# EAGLE design yaw (EAGLE 9.6.2)
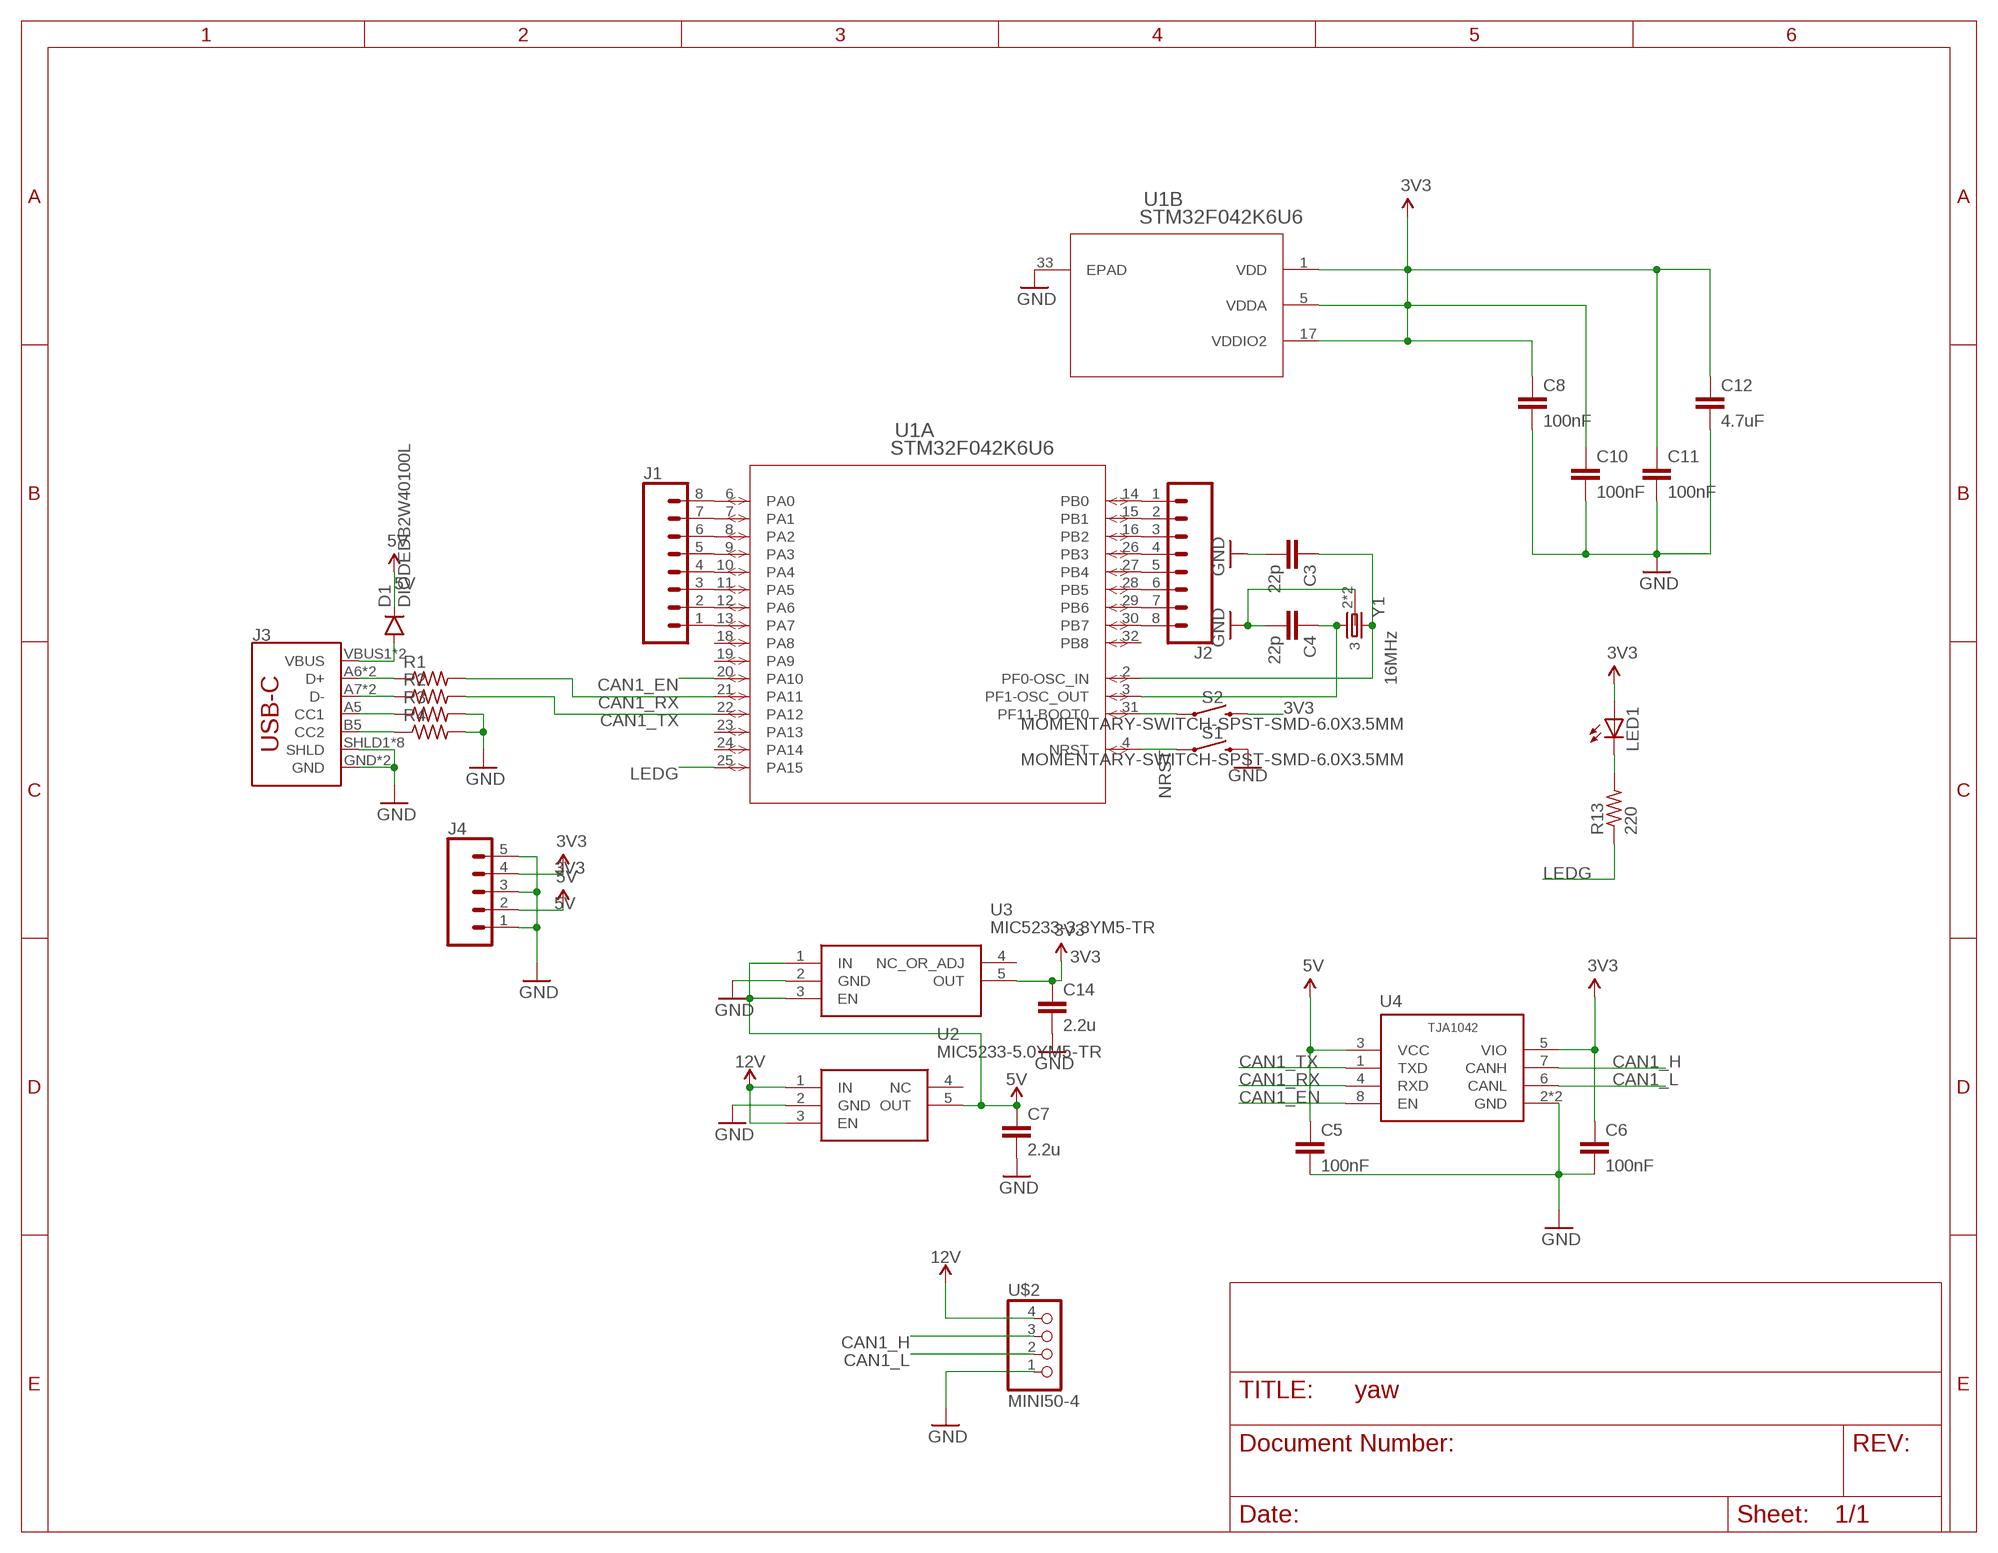
[diagram p0: schematic, sheet 1]

## Parts
C3  22p  C0603  [0603-C]
C4  22p  C0603  [0603-C]
C5  100nF  C0603  [0603-C]
C6  100nF  C0603  [0603-C]
C7  2.2u  C-EUC0603  [C0603]
C8  100nF  C0603  [0603-C]
C10  100nF  C0603  [0603-C]
C11  100nF  C0603  [0603-C]
C12  4.7uF  C0603  [0603-C]
C14  2.2u  C-EUC0603  [C0603]
D1  DIODEDB2W40100L  [SOD-123F]
J1  CONN_08"  [1X08]
J2  CONN_08"  [1X08]
J3  USB-C-BREAKOUT_SPARKFUN-CONNECTORS_USB_C16PIN  [USB-C-BREAKOUT_SPARKFUN-CONNECTORS_USB-C-16P]
J4  CONN_05  [1X05]
LED1  LEDCHIPLED_0805  [CHIPLED_0805]
R1  R0402  [0402-R]
R2  R0402  [0402-R]
R3  R0402  [0402-R]
R4  R0402  [0402-R]
R13  220  R0402  [0402-R]
S1  MOMENTARY-SWITCH-SPST-SMD-6.0X3.5MM  [TACTILE_SWITCH_SMD_6.0X3.5MM]
S2  MOMENTARY-SWITCH-SPST-SMD-6.0X3.5MM  [TACTILE_SWITCH_SMD_6.0X3.5MM]
U1  STM32F042K6U6  [UFQFPN32-5X5MM]
U2  MIC5233-5.0YM5-TR  [SOT95P280X145-5N]
U3  MIC5233-3.3YM5-TR  [SOT95P280X145-5N]
U4  TJA1042HVSON  [HVSON8]
U$2  MINI50-4  [MINI50]
Y1  16MHz  CRYSTAL-3.2X2.54-PIN  [XTAL-3.2X2.5]

## Nets
3V3: C6.1 C8.1 C10.1 C11.1 C12.1 C14.1 J4.4 LED1.A S2.2 U1.1(B:VDD) U1.5(B:VDDA) U1.17(B:VDDIO2) U3.5(OUT) U4.5(VIO)
5V: C5.1 C7.1 D1.1(C) J4.2 U2.5(OUT) U3.1(IN) U3.3(EN) U4.3(VCC)
12V: U2.1(IN) U2.3(EN) U$2.4
CAN1_EN: U1.20(A:PA10) U4.8(EN)
CAN1_H: U4.7(CANH) U$2.3
CAN1_L: U4.6(CANL) U$2.2
CAN1_RX: R1.2 U1.21(A:PA11) U4.4(RXD)
CAN1_TX: R2.2 U1.22(A:PA12) U4.1(TXD)
GND: C3.2 C4.2 C5.2 C6.2 C7.2 C8.2 C10.2 C11.2 C12.2 C14.2 J3.GND J3.GND2(GND) J3.SHLD1(SHLD) J3.SHLD2(SHLD) J3.SHLD3(SHLD) J3.SHLD4(SHLD) J3.SHLD5(SHLD) J3.SHLD6(SHLD) J3.SHLD7(SHLD) J3.SHLD8(SHLD) J4.1 J4.3 J4.5 R3.2 R4.2 S1.2 U1.33(B:EPAD) U2.2(GND) U3.2(GND) U4.2(GND) U4.PAD(GND) U$2.1 Y1.2 Y1.4
LEDG: R13.1 U1.25(A:PA15)
N$2: J1.1 U1.13(A:PA7)
N$3: C3.1 U1.2(A:PF0-OSC_IN) Y1.1
N$4: J1.2 U1.12(A:PA6)
N$5: J1.3 U1.11(A:PA5)
N$6: J1.4 U1.10(A:PA4)
N$7: S2.1 U1.31(A:PF11-BOOT0)
N$8: J1.5 U1.9(A:PA3)
N$9: J1.6 U1.8(A:PA2)
N$10: J1.7 U1.7(A:PA1)
N$11: J1.8 U1.6(A:PA0)
N$12: J2.1 U1.14(A:PB0)
N$13: J2.2 U1.15(A:PB1)
N$14: J2.3 U1.16(A:PB2)
N$15: J2.4 U1.26(A:PB3)
N$16: J2.5 U1.27(A:PB4)
N$17: J2.6 U1.28(A:PB5)
N$18: J2.7 U1.29(A:PB6)
N$19: J2.8 U1.30(A:PB7)
N$20: D1.2(A) J3.VBUS1(VBUS) J3.VBUS2(VBUS)
N$22: J3.A6(D+) J3.B6(D+) R1.1
N$23: J3.A7(D-) J3.B7(D-) R2.1
N$24: J3.A5(CC1) R3.1
N$25: J3.B5(CC2) R4.1
N$26: LED1.C R13.2
N$27: C4.1 U1.3(A:PF1-OSC_OUT) Y1.3
NRST: S1.1 U1.4(A:NRST)
Unconnected: U1.18(A:PA8) U1.19(A:PA9) U1.23(A:PA13) U1.24(A:PA14) U1.32(A:PB8) U2.4(NC) U3.4(NC_OR_ADJ)

## Library data of the parts
C3-C6 C8 C10-C12 = comma.ai:C
C7 C14 = rcl:C-EU: CAPACITOR, European symbol; SPICEPREFIX: C
D1 = comma.ai:DIODE
J1 J2 = SparkFun-Connectors:CONN_08: Multi connection point. Often used as Generic Header-pin footprint for 0.1 inch spaced/style header connections On any of the 0.1 inch spaced packages, you can populate with these: Break Away Headers - Straight <https://www.sparkfun.com/products/116> (PRT-00116) Break Away Male Headers - Right Angle <https://www.sparkfun.com/products/553> (PRT-00553) Female Headers <https://www.sparkfun.com/products/115> (PRT-00115) Break Away Headers - Machine Pin <https://www.sparkfun.com/products/117> (PRT-00117) Break Away Female Headers - Swiss Machine Pin <https://www.sparkfun.com/products/743> (PRT-00743) Arduino Stackable Header - 8 Pin <https://www.sparkfun.com/products/9279> (PRT-09279) For SCREWTERMINALS and SPRING TERMINALS visit here: Screw Terimnals on SparkFun.com <https://www.sparkfun.com/search/results?term=Screw+Terminals> (5mm/3.5mm/2.54mm spacing) This device is also useful as a general connection point to wire up your design to another part of your project. Our various solder wires solder well into these plated through hole pads. Hook-Up Wire - Assortment (Stranded, 22 AWG) <https://www.sparkfun.com/products/11375> (PRT-11375) Hook-Up Wire - Assortment (Solid Core, 22 AWG) <https://www.sparkfun.com/products/11367> (PRT-11367) View the entire wire category on our website here <https://www.sparkfun.com/categories/141> Special notes: Molex polarized connector foot print use with SKU : PRT-08231 with associated crimp pins and housings. 1MM SMD Version SKU: PRT-10208 NOTES ON THE VARIANTS LOCK and LOCK_LONGPADS... This footprint was designed to help hold the alignment of a through-hole component (i.e. 6-pin header) while soldering it into place. You may notice that each hole has been shifted either up or down by 0.005 of an inch from it's more standard position (which is a perfectly straight line). This slight alteration caused the pins (the squares in the middle) to touch the edges of the holes. Because they are alternating, it causes a "brace" to hold the component in place. 0.005 has proven to be the perfect amount of "off-center" position when using our standard breakaway headers. Although looks a little odd when you look at the bare footprint, once you have a header in there, the alteration is very hard to notice. Also,if you push a header all the way into place, it is covered up entirely on the bottom side.; PROD_ID: CONN-08438
J3 = ROTR-Wireless:USB-C-BREAKOUT_SPARKFUN-CONNECTORS_USB_C: USB Type C 16Pin Connector Super Speed pins not available on the 16-pin purely SMD connector so this part is best for USB 2.0 implementations. D1 and D2 are tied together enabling D+/- no matter which way the cable is plugged into the connector. The two channel configuration pins (CC1/2) are exposed. These are normally connected to ground via 5.1k resistors but can be reconfigured for high current/high power applications.; PROD_ID: CONN-14122
J4 = SparkFun-Connectors:CONN_05: Multi connection point. Often used as Generic Header-pin footprint for 0.1 inch spaced/style header connections On any of the 0.1 inch spaced packages, you can populate with these: Break Away Headers - Straight <https://www.sparkfun.com/products/116> (PRT-00116) Break Away Male Headers - Right Angle <https://www.sparkfun.com/products/553> (PRT-00553) Female Headers <https://www.sparkfun.com/products/115> (PRT-00115) Break Away Headers - Machine Pin <https://www.sparkfun.com/products/117> (PRT-00117) Break Away Female Headers - Swiss Machine Pin <https://www.sparkfun.com/products/743> (PRT-00743) For SCREWTERMINALS and SPRING TERMINALS visit here: Screw Terimnals on SparkFun.com <https://www.sparkfun.com/search/results?term=Screw+Terminals> (5mm/3.5mm/2.54mm spacing) This device is also useful as a general connection point to wire up your design to another part of your project. Our various solder wires solder well into these plated through hole pads. Hook-Up Wire - Assortment (Stranded, 22 AWG) <https://www.sparkfun.com/products/11375> (PRT-11375) Hook-Up Wire - Assortment (Solid Core, 22 AWG) <https://www.sparkfun.com/products/11367> (PRT-11367) View the entire wire category on our website here <https://www.sparkfun.com/categories/141> Special notes: Molex polarized connector foot print use with SKU : PRT-08231 with associated crimp pins and housings. 1MM SMD Version SKU: PRT-10208
LED1 = adafruit:LED: LED OSRAM: - CHIPLED LG R971, LG N971, LY N971, LG Q971, LY Q971, LO R971, LY R971 LH N974, LH R974 LS Q976, LO Q976, LY Q976 LO Q996 - Hyper CHIPLED LW Q18S LB Q993, LB Q99A, LB R99A - SideLED LS A670, LO A670, LY A670, LG A670, LP A670 LB A673, LV A673, LT A673, LW A673 LH A674 LY A675 LS A676, LA A676, LO A676, LY A676, LW A676 LS A679, LY A679, LG A679 - Hyper Micro SIDELED® LS Y876, LA Y876, LO Y876, LY Y876 LT Y87S - SmartLED LW L88C, LW L88S LB L89C, LB L89S, LG L890 LS L89K, LO L89K, LY L89K LS L896, LA L896, LO L896, LY L896 - TOPLED LS T670, LO T670, LY T670, LG T670, LP T670 LSG T670, LSP T670, LSY T670, LOP T670, LYG T670 LG T671, LOG T671, LSG T671 LB T673, LV T673, LT T673, LW T673 LH T674 LS T676, LA T676, LO T676, LY T676, LB T676, LH T676, LSB T676, LW T676 LB T67C, LV T67C, LT T67C, LS T67K, LO T67K, LY T67K, LW E67C LS E67B, LA E67B, LO E67B, LY E67B, LB E67C, LV E67C, LT E67C LW T67C LS T679, LY T679, LG T679 LS T770, LO T770, LY T770, LG T770, LP T770 LB T773, LV T773, LT T773, LW T773 LH T774 LS E675, LA E675, LY E675, LS T675 LS T776, LA T776, LO T776, LY T776, LB T776 LHGB T686 LT T68C, LB T68C - Hyper Mini TOPLED® LB M676 - Mini TOPLED Santana® LG M470 LS M47K, LO M47K, LY M47K Source: http://www.osram.convergy.de/
R1-R4 R13 = comma.ai:R
S1 S2 = SparkFun-Switches:MOMENTARY-SWITCH-SPST: Momentary Switch (Pushbutton) - SPST Normally-open (NO) SPST momentary switches (buttons, pushbuttons). Variants PTH-12MM - 12mm square, through-hole Momentary Pushbutton Switch - 12mm Square <https://www.sparkfun.com/products/9190> (COM-09190) PTH-6.0MM, PTH-6.0MM-KIT - 6.0mm square, through-hole Mini Pushbutton Switch <https://www.sparkfun.com/products/97> (COM-00097) KIT package intended for soldering kit's - only one side of pads' copper is exposed. PTH-RIGHT-ANGLE-KIT - Right-angle, through-hole Right Angle Tactile Button <https://www.sparkfun.com/products/10791> - Used on SparkFun BigTime Watch Kit <https://www.sparkfun.com/products/11734> SMD-12MM - 12mm square, surface-mount Tactile Button - SMD (12mm) <https://www.sparkfun.com/products/12993> (COM-12993) Used on SparkFun PicoBoard <https://www.sparkfun.com/products/11888> SMD-4.5MM - 4.5mm Square Trackball Switch Used on SparkFun Blackberry Trackballer Breakout <https://www.sparkfun.com/products/13169> SMD-4.6MMX2.8MM - 4.60mm x 2.80mm, surface mount Used on SparkFun SAMD21 Mini Breakout <https://www.sparkfun.com/products/13664> SMD-5.2MM, SMD-5.2-REDUNDANT - 5.2mm square, surface-mount Mini Pushbutton Switch - SMD <https://www.sparkfun.com/products/8720> (COM-08720) Used on Arduino Pro Mini <https://www.sparkfun.com/products/11114> REDUNDANT package connects both switch circuits together SMD-6.0X3.5MM - 6.0 x 3.5mm, surface mount Momentary Reset Switch SMD <https://www.sparkfun.com/products/8229> (COM-08229) SMD-6.2MM-TALL - 6.2mm square, surface mount Tactile Button - SMD (6mm) <https://www.sparkfun.com/products/12992> Used on SparkFun Digital Sandbox <https://www.sparkfun.com/products/12651> SMD-RIGHT-ANGLE - Right-angle, surface mount Used on SparkFun Block for Intel® Edison - Arduino <https://www.sparkfun.com/products/13036>; PROD_ID: SWCH-00815; SF_SKU: COM-08229
U1 = interceptor:STM32F042K6U6; BUILT_BY: EMA_UL_Team; COPYRIGHT: Copyright (C) 2018 Accelerated Designs. All rights reserved; MANUFACTURER_PART_NUMBER: STM32F042K6U6; SOURCELIBRARY: Updates_to_database_2020-10-19; VENDOR: STMicroelectronics
U2 = SamacSys_Parts:MIC5233-5.0YM5-TR: MICROCHIP - MIC5233-5.0YM5-TR - LDO, REG, 36VIN, 0.1A, 5V, 2%, 5SOT23 Source: Datasheet <https://componentsearchengine.com/Datasheets/2/MIC5233-5.0YM5-TR.pdf>; DESCRIPTION: MICROCHIP - MIC5233-5.0YM5-TR - LDO, REG, 36VIN, 0.1A, 5V, 2%, 5SOT23; HEIGHT: 1.45mm; MANUFACTURER_NAME: Microchip; MANUFACTURER_PART_NUMBER: MIC5233-5.0YM5-TR; MOUSER_PART_NUMBER: 998-MIC5233-5.0YM5TR; MOUSER_PRICE-STOCK: https://www.mouser.co.uk/ProductDetail/Microchip-Technology-Micrel/MIC5233-50YM5-TR?qs=U6T8BxXiZAWSnpCHgrMajw%3D%3D
U3 = SamacSys_Parts:MIC5233-3.3YM5-TR: High Input Voltage Low IQ UCAP LDO Regulator Source: Datasheet <http://ww1.microchip.com/downloads/en/DeviceDoc/MIC5233-Data-Sheet-DS20006033D.pdf>; DESCRIPTION: High Input Voltage Low IQ UCAP LDO Regulator; HEIGHT: 1.45mm; MANUFACTURER_NAME: Microchip; MANUFACTURER_PART_NUMBER: MIC5233-3.3YM5-TR; MOUSER_PART_NUMBER: 998-MIC5233-3.3YM5TR; MOUSER_PRICE-STOCK: https://www.mouser.co.uk/ProductDetail/Microchip-Technology-Micrel/MIC5233-33YM5-TR?qs=U6T8BxXiZAWDhshLMgpaLQ%3D%3D
U4 = comma.ai:TJA1042
U$2 = interceptor:MINI50-4
Y1 = comma.ai:CRYSTAL-3.2X2.5

## Board
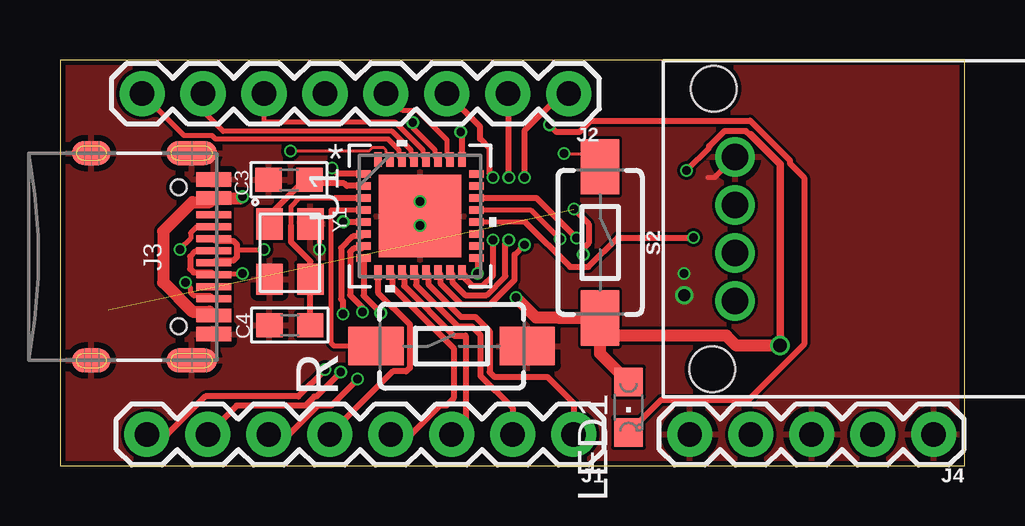
[diagram p1: board, top side]
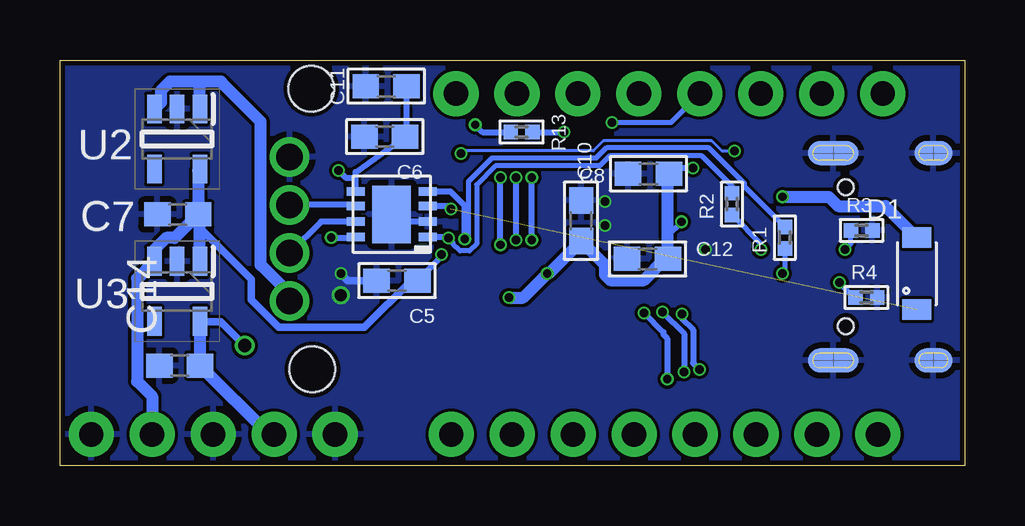
[diagram p2: board, bottom side, seen from below]

Size 37.7 x 16.9 mm. Coordinates in mm from the lower left corner, seen from the top.
Outline: 0,0 37.7,0 37.7,16.9 0,16.9 0,0
Copper layers (1*16): Top 0.035559375mm / dielectric 1.6mm / Bottom 0.035559375mm
Design rules "jlcpcb2layer": minimum track width 5mil, minimum drill 12mil, track to track 5mil, track to pad 5mil, pad to pad 5mil, via to via 5mil, smd to smd 5mil, copper to edge 8mil, drill to drill 6mil, minimum pad ring 5mil, minimum via ring 3mil, stop-mask expansion 2.5mil, vias tented up to drill 0mil, thermal gap 10mil

### Footprints (pad centres in the part's own frame; a part is rotated, then mirrored left to right if it is on the bottom)
0603-C = smd 1.1 x 1: 1 -0.85,0; 2 0.85,0
C0603 = smd 1.1 x 1: 1 -0.85,0; 2 0.85,0
SOD-123F = smd 1.2 x 0.85: 1 0,-1.5; 2 0,1.5
1X08 = drill 1.016 pad 1.88: 1 0,0; 2 2.54,0; 3 5.08,0; 4 7.62,0; 5 10.16,0; 6 12.7,0; 7 15.24,0; 8 17.78,0
USB-C-BREAKOUT_SPARKFUN-CONNECTORS_USB-C-16P = smd 0.3 x 1.45: A5 -1.25,0; A6 -0.25,0; A7 0.25,0; A8 1.25,0; B5 1.75,0; B6 0.75,0; B7 -0.75,0; B8 -1.75,0 | smd 0.6 x 1.45: GND -3.225,0; GND2 3.225,0 | smd 1 x 2.1: SHLD1 -4.32,-0.915; SHLD2 4.32,-0.915 | smd 1 x 2.1 bottom: SHLD3 -4.32,-0.915; SHLD4 4.32,-0.915 | smd 1 x 1.6: SHLD5 -4.32,-5.095; SHLD8 4.32,-5.095 | smd 1 x 1.6 bottom: SHLD6 -4.32,-5.095; SHLD7 4.32,-5.095 | smd 0.55 x 1.45: VBUS1 -2.45,0; VBUS2 2.45,0 | hole 0.65: -2.89,-1.445; 2.89,-1.445
1X05 = drill 1.016 pad 1.88: 1 0,0; 2 2.54,0; 3 5.08,0; 4 7.62,0; 5 10.16,0
CHIPLED_0805 = smd 1.2 x 1.2: A 0,-1.05; C 0,1.05
0402-R = smd 0.6 x 0.6: 1 -0.45,0; 2 0.45,0
TACTILE_SWITCH_SMD_6.0X3.5MM = smd 2.3 x 1.6: 1 -3.15,0; 2 3.15,0
UFQFPN32-5X5MM = smd 0.61 x 0.305: 1 -2.35,1.75; 2 -2.35,1.25; 3 -2.35,0.75; 4 -2.35,0.25; 5 -2.35,-0.25; 6 -2.35,-0.75; 7 -2.35,-1.25; 8 -2.35,-1.75; 17 2.35,-1.75; 18 2.35,-1.25; 19 2.35,-0.75; 20 2.35,-0.25; 21 2.35,0.25; 22 2.35,0.75; 23 2.35,1.25; 24 2.35,1.75 | smd 0.305 x 0.61: 9 -1.75,-2.35; 10 -1.25,-2.35; 11 -0.75,-2.35; 12 -0.25,-2.35; 13 0.25,-2.35; 14 0.75,-2.35; 15 1.25,-2.35; 16 1.75,-2.35; 25 1.75,2.35; 26 1.25,2.35; 27 0.75,2.35; 28 0.25,2.35; 29 -0.25,2.35; 30 -0.75,2.35; 31 -1.25,2.35; 32 -1.75,2.35 | smd 3.454 x 3.454: 33 0,0
SOT95P280X145-5N = smd 1.2 x 0.6: 1 -1.25,0.95; 2 -1.25,0; 3 -1.25,-0.95; 4 1.25,-0.95; 5 1.25,0.95
HVSON8 = smd 0.75 x 0.35: 1 -1.5,0.95; 2 -1.5,0.3; 3 -1.5,-0.35; 4 -1.5,-0.95; 5 1.5,-0.95; 6 1.5,-0.35; 7 1.5,0.3; 8 1.5,0.95 | smd 1.6 x 2.4: PAD 0,0
MINI50 = drill 1.1: 1 0,0; 2 2,0; 3 4,0; 4 6,0 | hole 1.9: -2.85,-0.9; 8.85,-0.95
XTAL-3.2X2.5 = smd 1.3 x 1.1: 1 0,-1.8; 2 2.3,-1.8; 3 2.3,-0.1; 4 0,-0.1

### Placement (x,y rotation side)
C3  9.54,11.91 180 top
C4  9.58,5.85 180 top
C5  23.66,7.71 180 bottom
C6  24.17,13.71 180 bottom
C7  32.79,10.47 180 bottom
C8  13.18,12.16 180 bottom
C10  15.99,10.2 90 bottom
C11  24.11,15.81 180 bottom
C12  13.22,8.61 180 bottom
C14  32.71,4.17 180 bottom
D1  2,8 0 bottom
J1  21.4,1.3 180 top
J2  21.2,15.5 180 top
J3  6.4,8.7 270 top
J4  36.4,1.3 180 top
LED1  23.69,2.43 180 top
R1  7.5,9.5 90 bottom
R2  9.7,10.9 90 bottom
R3  4.3,9.8 0 bottom
R4  4.1,7 0 bottom
R13  18.47,13.9 180 bottom
S1  16.32,4.98 0 top
S2  22.5,9.3 270 top
U1  15,10.4 0 top
U2  32.82,13.61 270 bottom
U3  32.82,7.26 270 bottom
U4  23.88,10.47 180 bottom
U$2  28.13,12.86 270 top
Y1  10.53,10.07 270 top

### Tracks (layer width: path | path; a pad name or v marks a point on that pad's centre or on a via)
3V3  (via drill 0.35, 0.55)
  Top 0.254: U1.1 11.58,12.15 v11.33,12.4 | U1.5 v11.81,10.15 v11.8,10.16 | U1.17 17.4,8.6 v17.4,8 | 28.78,13.78 28.74,13.78 28.58,13.94 27.68,13.94 27.05,13.31 27.05,13.25 v26.1,12.3
  Top 0.305: v30,5 30,12.55 28.78,13.78
  Top 0.508: v30,5 28.18,5 27.76,5.42 23.23,5.42 S2.2 | S2.2 20.79,6.15 20.78,6.16 19.84,6.16 v19,7 | LED1.A 22.5,4.67 S2.2
  Bottom 0.254: U4.5 25.38,12 | 25.38,12 25.38,12.23 C6.1 23.26,13.77 C11.1 | v11.33,12.4 12.09,12.4 C8.1 | v11.8,10.16 12.37,9.59 C12.1 | v26.1,12.3 25.8,12 25.38,12
  Bottom 0.305: U3.5 31,6 v30,5
  Bottom 0.508: U3.5 C14.1 28.99,1.3 J4.4 | C8.1 12.37,12.12 C12.1 12.48,8.61 13.36,7.73 14.78,7.73 15,7.95 15,8.36 C10.1 17.34,8 v17.4,8 18.4,7 v19,7
5V  (via drill 0.35)  (1 unrouted)
  Top 0.254: v21.8,8.8 21.8,9.04 22.03,9.27 22.03,10.07 v21.41,10.69
  Bottom 0.254: U4.3 21.55,10.82 v21.41,10.69 | v21.8,8.8 21.8,8.72 C5.1
  Bottom 0.305: C5.1 23.07,7.71 25.02,5.76 28.59,5.76 29.73,6.9 29.73,7.76 31.94,9.97 C7.1
  Bottom 0.508: U2.5 31.94,12.29 C7.1 | C7.1 32.92,9.49 33.28,9.49 33.77,9 U3.3 34.49,7.79 34.49,3.51 33.86,2.88 J4.2 | U3.1 31.87,10.4 C7.1
12V
  Bottom 0.508: U$2.4 28.13,7.15 29.34,8.36 29.34,14.34 31,16 32,16 | U2.3 33.5,15.13 33.5,15.62 33.12,16 32,16 | U2.1 31.87,15.87 32,16
CAN1_EN  (via drill 0.35)
  Top 0.203: 19.39,10.15 U1.20
  Top 0.254: 19.39,10.15 21.26,8.28 22.01,8.28 23.23,9.5 v26.4,9.5
  Bottom 0.254: v26.4,9.5 25.4,9.5 U4.8
CAN1_H
  Bottom 0.254: U4.7 26.82,10.17 U$2.3
CAN1_L
  Bottom 0.254: U4.6 25.42,10.86 U$2.2
CAN1_RX  (via drill 0.35)
  Top 0.2: v20.84,9.44 19.63,10.63
  Top 0.203: 19.63,10.63 17.37,10.63 U1.21
  Bottom 0.203: v20.84,9.44 20.67,9.6 20.67,11.84 19.69,12.82 15.35,12.82 14.93,13.24 10.67,13.24 9.17,11.74 9.17,11.62 R1.2
  Bottom 0.254: v20.84,9.44 20.84,10.84 21.42,11.42 U4.4
CAN1_TX  (via drill 0.35)
  Top 0.254: U1.22 19.85,11.15 v21.51,9.49
  Bottom 0.203: R2.2 9.7,11.65 10.96,12.91 14.8,12.91 15.21,12.49 19.55,12.49 20.34,11.7 20.34,9.23 20.63,8.94 21.04,8.94 21.33,9.23 21.33,9.3 v21.51,9.49
  Bottom 0.254: v21.51,9.49 21.51,9.52 U4.1
GND  (via drill 0.35, 0.5)
  Top 0.2: U$2.1 27.27,12 27,12 | Y1.4 10.81,9.69 v10.81,9
  Bottom 0.2: v10.81,9 11,9
  Bottom 0.254: U4.2 23.58,10.17 U4.PAD
  Bottom 0.305: C5.2 25.71,7.71 v26,8
  other vias: 26,7.1 15,11 15,10
  pour Top: 0,0 0,16.9 37.7,16.9 37.7,0
  pour Bottom: 0,0 0,16.9 37.7,16.9 37.7,0
LEDG  (via drill 0.35)
  Top 0.254: U1.25 16.75,13.85 v16.7,13.9
  Bottom 0.254: R13.1 v16.7,13.9
N$2
  Top 0.254: U1.13 15.34,7.96 15.34,7.56 16.71,6.2 17.3,6.2 17.9,5.6 17.9,3.9 18.1,3.7 20.3,3.7 21.4,2.6 J1.1
N$3
  Top 0.254: Y1.1 8.73,10.45 10.19,11.91 C3.1 10.54,11.76 11.84,11.76 11.95,11.65 U1.2
N$4
  Top 0.254: U1.12 14.84,7.96 14.84,7.52 16.57,5.8 17.16,5.8 17.52,5.44 17.52,3.74 18.86,2.4 J1.2
N$5
  Top 0.254: U1.11 14.34,7.96 14.34,7.48 16.41,5.42 16.9,5.42 16.9,1.88 J1.3
N$6
  Top 0.254: U1.10 13.84,7.96 13.84,7.45 16.4,4.89 16.4,2.8 16.09,2.49 15.83,2.49 14.63,1.3 J1.4
N$7  (via drill 0.35)
  Top 0.127: U1.31 13.59,12.91 13.59,13.13 13.48,13.24 13.02,13.24 12.87,13.1 v9.6,13.1 | v21,13 21.95,13 S2.1
  Bottom 0.127: v9.6,13.1 10.11,13.1 10.54,13.53 15.05,13.53 15.47,13.11 20.89,13.11 v21,13
N$8
  Top 0.254: U1.9 13.25,7.21 14.57,5.88 14.57,4.08 14.43,3.93 13.87,3.93 J1.5
N$9  (via drill 0.35)
  Top 0.254: U1.8 12.65,7.08 v13.36,6.36 | v12.4,3.6 11.29,2.49 10.75,2.49 9.55,1.3 J1.6
  Bottom 0.254: v13.36,6.36 12.56,5.56 12.56,5.46 12.4,5.3 v12.4,3.6
N$10  (via drill 0.35)
  Top 0.254: U1.7 12.56,9.06 12.24,9.06 12.09,8.91 12.09,7.1 12.6,6.59 v12.6,6.4 | v11.7,3.9 10.68,2.88 10.59,2.88 10.21,2.5 7.36,2.5 J1.7
  Bottom 0.254: v12.6,6.4 11.7,5.5 v11.7,3.9
N$11  (via drill 0.35)
  Top 0.254: U1.6 12.56,9.56 12.2,9.56 11.71,9.06 11.71,6.94 11.79,6.86 v11.79,6.32 | v11.05,4 9.93,2.88 6.05,2.88 4.47,1.3 J1.8
  Bottom 0.254: v11.79,6.32 11.79,6.13 11.32,5.66 11.32,4.27 v11.05,4
N$12  (via drill 0.35)
  Top 0.254: v19.35,9.2 18.94,8.79 18.94,7.73 17.93,6.72 16.72,6.72 15.84,7.6 15.84,7.96 U1.14 | J2.1 20.9,15.5 19.35,13.95 v19.35,12
  Bottom 0.254: v19.35,9.2 v19.35,12
N$13  (via drill 0.35)
  Top 0.254: v18.7,9.4 18.56,9.26 18.56,7.89 17.77,7.1 16.88,7.1 16.34,7.64 16.34,7.96 U1.15 | v18.7,12 18.7,15.46 J2.2
  Bottom 0.254: v18.7,9.4 v18.7,12
N$14  (via drill 0.35)
  Top 0.254: U1.16 16.88,7.92 16.88,7.79 17.19,7.48 17.61,7.48 18.04,7.91 v18.04,9.4 | v18.04,12 17.91,12.14 17.91,13.21 17.5,13.62 17.5,14.12 J2.3
  Bottom 0.254: v18.04,9.4 | v18.04,9.4 v18.04,12
N$15
  Top 0.2: U1.26 16.13,12.87 16.13,13.56 14.9,14.79 14.29,14.79 J2.4
N$16  (via drill 0.35)
  Top 0.2: U1.27 15.63,12.87 15.63,13.15 14.7,14.08 v14.7,14.3
  Bottom 0.2: v14.7,14.3 12.24,14.3 J2.5
N$17
  Top 0.2: U1.28 15.13,12.87 15.13,13.15 13.98,14.3 8.5,14.3 J2.6
N$18
  Top 0.2: U1.29 14.63,12.87 14.63,13.15 13.85,13.93 6.8,13.93 5.96,14.77 J2.7
N$19
  Top 0.2: U1.30 14.13,12.87 14.13,13.15 13.68,13.6 6.48,13.6 6.34,13.75 5.17,13.75 J2.8
N$20  (via drill 0.35)
  Top 0.508: J3.VBUS2 6.23,6.42 5.52,6.42 4.3,7.64 4.3,9.76 5.52,10.98 6.23,10.98 J3.VBUS1 7.55,11.15 v7.6,11.2
  Bottom 0.508: v7.6,11.2 5.67,11.2 5.28,10.81 3.31,10.81 D1.2
N$22  (via drill 0.35)
  Top 0.203: J3.B6 6.45,8 v7.6,8
  Top 0.254: J3.A6 6.38,8.93 5.64,8.93 5.42,8.7 5.42,8.2 5.57,8.05 6.3,8.05 J3.B6
  Bottom 0.203: R1.1 7.5,7.9 v7.6,8
N$23  (via drill 0.35)
  Top 0.203: 7.38,9 v8.5,9
  Top 0.254: J3.A7 6.5,8.55 7.23,8.55 7.38,8.7 7.38,9 7.38,9.2 7.23,9.35 6.5,9.35 J3.B7
  Bottom 0.203: v8.5,9 8.5,9.25 R2.1
N$24  (via drill 0.35)
  Top 0.203: v4.99,9.01 5.45,9.46 5.45,9.7 5.7,9.95 J3.A5
  Bottom 0.203: v4.99,9.01 4.75,9.25 R3.1
N$25  (via drill 0.35)
  Top 0.203: J3.B5 6.28,7.07 5.58,7.07 5.45,7.2 5.45,7.4 v5.22,7.62
  Bottom 0.203: v5.22,7.62 4.6,7 R4.1
N$26  (via drill 0.35)
  Top 0.254: v20.4,14.2 20.7,13.9 21.64,13.9 22.11,14.37 28.76,14.37 30.41,12.72 30.41,12.59 31,12 31,5.06 28.67,2.73 25.04,2.73 LED1.C
  Bottom 0.254: v20.4,14.2 20.1,13.9 R13.2
N$27
  Top 0.2: 9.63,10 9.63,10.79 10,11.16 11.46,11.16
  Top 0.254: C4.1 Y1.3 10.43,8.51 9.63,9.31 9.63,10 | U1.3 11.46,11.16
NRST
  Top 0.2: S1.1 11.42,4.98 11.3,5.1 11.3,10.65 U1.4

### Text on the board
tNames: R